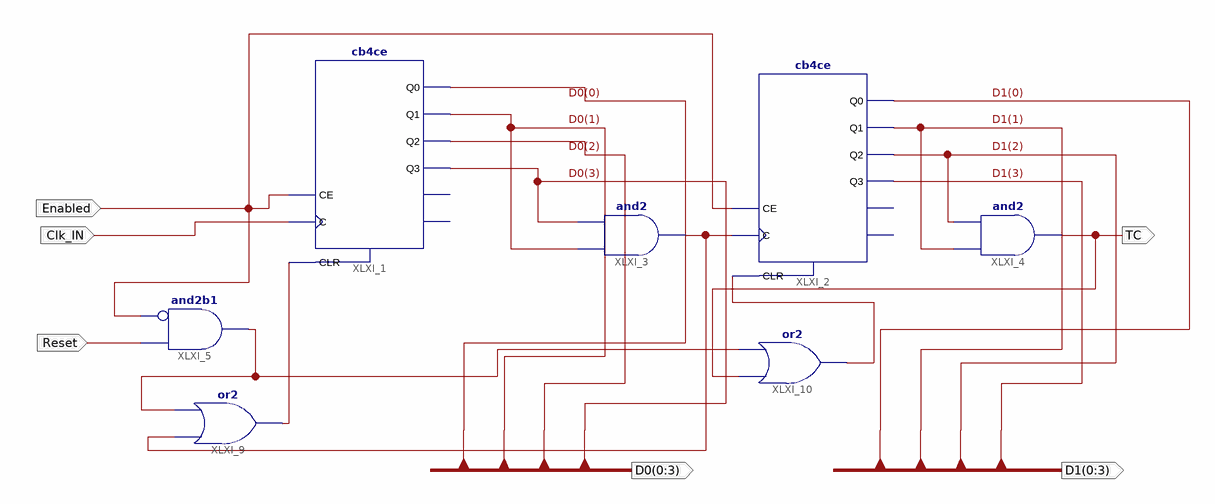
[diagram p0: schematic sheet 1]
// Xilinx ISE schematic Second.sch (spartan6) as structural Verilog: 7 symbols, 6 ports
module Second (
  input  Clk_IN,
  input  Enabled,
  input  Reset,
  output TC,
  output [0:3] D0,
  output [0:3] D1
);

  wire XLXN_51;

  cb4ce XLXI_1 (.C(Clk_IN), .CE(Enabled), .CLR(TC), .Q0(D0[0]), .Q1(D0[1]), .Q2(D0[2]), .Q3(D0[3]));  // open: CEO, TC
  cb4ce XLXI_2 (.C(TC), .CE(Enabled), .CLR(XLXN_51), .Q0(D1[0]), .Q1(D1[1]), .Q2(D1[2]), .Q3(D1[3]));  // open: CEO, TC
  and XLXI_3 (TC, D0[1], D0[3]);
  and XLXI_4 (TC, D1[1], D1[2]);
  and XLXI_5 (TC, ~Enabled, Reset);  // and2b1
  or XLXI_9 (TC, TC, TC);
  or XLXI_10 (XLXN_51, TC, TC);
endmodule
